# Altium project UWB_board.PrjPcb
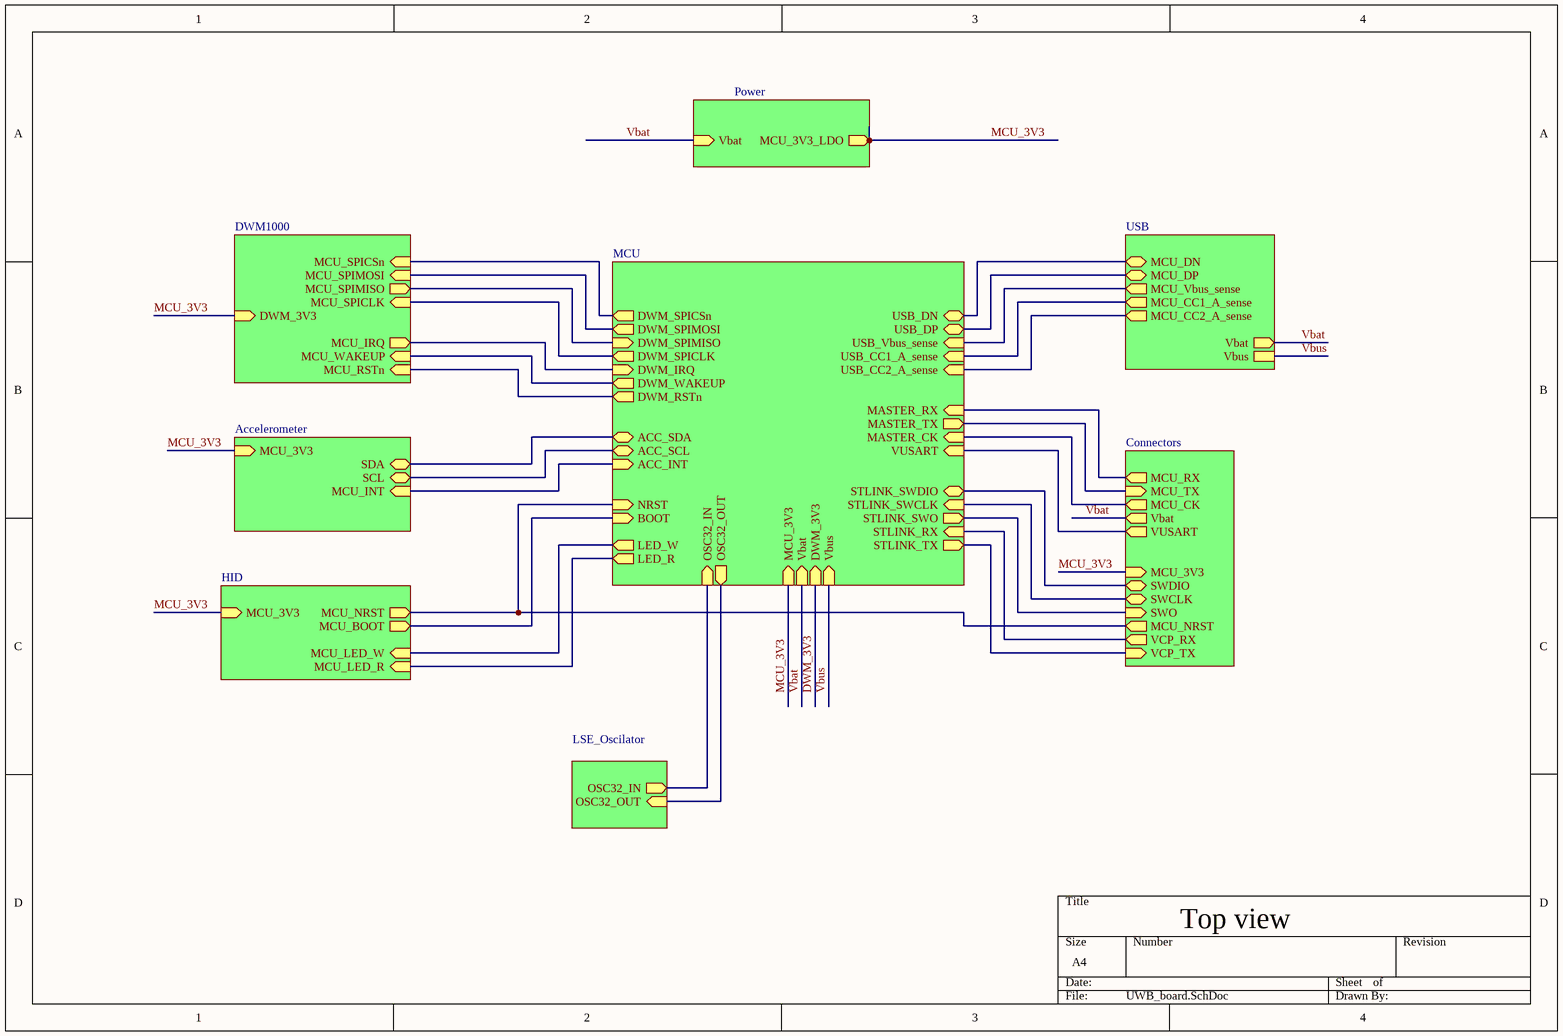
[diagram p0: UWB_board.SchDoc]
9 sheets, 52 parts. Net scope: hierarchical (ports join the sheet entries above them; power ports are global).
Board file: UWB_board.PcbDoc
Sheets:
  UWB_board.SchDoc
     = MCU.SchDoc
     = Power.SchDoc
     = LSE_Oscilator.SchDoc
     = USB.SchDoc
     = Connectors.SchDoc
     = HID.SchDoc
     = DWM1000.SchDoc
     = Accelerometer.SchDoc

## Sheet UWB_board.SchDoc: Top view
size A4; Author: Jan Jiří Bauer; DrawnBy: Jan Jiří Bauer; Revision: 1.1; SheetNumber: 1; SheetTotal: 9

### Sub-sheets
? = MCU: DWM_SPICSn (out), DWM_SPIMOSI (out), DWM_SPIMISO (in), DWM_SPICLK (out), DWM_IRQ (in), DWM_WAKEUP (out), DWM_RSTn (out), USB_DN (bidir), USB_DP (bidir), USB_Vbus_sense (in), USB_CC1_A_sense (in), USB_CC2_A_sense (in), MASTER_RX (in), MASTER_TX (out), MASTER_CK (in), VUSART (in), STLINK_SWDIO (bidir), STLINK_SWCLK (in), NRST (in), STLINK_RX (in), STLINK_TX (out), ACC_SDA (bidir), ACC_SCL (bidir), ACC_INT (in), BOOT (in), OSC32_IN (in), OSC32_OUT (out), MCU_3V3 (in), Vbat (in), DWM_3V3 (in), Vbus (in), STLINK_SWO (out), LED_W (out), LED_R (out)
? = Power: MCU_3V3_LDO (out), Vbat (in)
? = LSE_Oscilator: OSC32_IN (out), OSC32_OUT (in)
? = USB: MCU_DP (bidir), MCU_DN (bidir), MCU_CC1_A_sense (out), MCU_CC2_A_sense (out), MCU_Vbus_sense (out), Vbat (out), Vbus
? = Connectors: MCU_TX (in), MCU_RX (out), MCU_CK (out), Vbat (out), VUSART (out), MCU_3V3 (in), SWDIO (bidir), SWCLK (bidir), MCU_NRST (out), VCP_TX (in), VCP_RX (out), SWO (in)
? = HID: MCU_3V3 (in), MCU_NRST (out), MCU_BOOT (out), MCU_LED_R (in), MCU_LED_W (in)
? = DWM1000: MCU_SPICSn (in), MCU_SPIMOSI (in), MCU_SPIMISO (out), MCU_SPICLK (in), DWM_3V3 (in), MCU_IRQ (out), MCU_WAKEUP (in), MCU_RSTn (in)
? = Accelerometer: MCU_3V3 (in), SDA (bidir), SCL (bidir), MCU_INT (in)

### Nets
D_N: sheet /USB_DN, sheet /MCU_DN
D_P: sheet /USB_DP, sheet /MCU_DP
DWM_3V3: sheet /DWM_3V3
MCU_3V3: sheet /MCU_3V3, sheet /MCU_3V3_LDO, sheet /MCU_3V3, sheet /MCU_3V3, sheet /DWM_3V3, sheet /MCU_3V3
NRST: sheet /NRST, sheet /MCU_NRST, sheet /MCU_NRST
PA0: sheet /DWM_IRQ, sheet /MCU_IRQ
PA1: sheet /DWM_SPICSn, sheet /MCU_SPICSn
PA15: sheet /STLINK_SWO, sheet /SWO
PB3: sheet /DWM_SPICLK, sheet /MCU_SPICLK
PB4: sheet /DWM_SPIMISO, sheet /MCU_SPIMISO
PB5: sheet /DWM_SPIMOSI, sheet /MCU_SPIMOSI
PB6: sheet /LED_R, sheet /MCU_LED_R
PB7: sheet /LED_W, sheet /MCU_LED_W
PB8: sheet /ACC_SCL, sheet /SCL
PB9: sheet /ACC_SDA, sheet /SDA
PC13: sheet /ACC_INT, sheet /MCU_INT
PF0: sheet /DWM_WAKEUP, sheet /MCU_WAKEUP
Vbat: sheet /Vbat, sheet /Vbat, sheet /Vbat, sheet /Vbat
Vbus: sheet /Vbus, sheet /Vbus
NetC8_2: sheet /OSC32_IN, sheet /OSC32_IN
NetC9_2: sheet /OSC32_OUT, sheet /OSC32_OUT
NetC12_2: sheet /BOOT, sheet /MCU_BOOT
NetJ1_2: sheet /VUSART, sheet /VUSART
NetJ4_1: sheet /MASTER_TX, sheet /MCU_TX
NetJ4_2: sheet /MASTER_RX, sheet /MCU_RX
NetJ4_3: sheet /MASTER_CK, sheet /MCU_CK
NetJ5_4: sheet /STLINK_SWDIO, sheet /SWDIO
NetJ5_6: sheet /STLINK_SWCLK, sheet /SWCLK
NetJ5_13: sheet /STLINK_RX, sheet /VCP_RX
NetJ5_14: sheet /STLINK_TX, sheet /VCP_TX
NetR3_1: sheet /USB_CC1_A_sense, sheet /MCU_CC1_A_sense
NetR4_1: sheet /USB_CC2_A_sense, sheet /MCU_CC2_A_sense
NetR10_1: sheet /USB_Vbus_sense, sheet /MCU_Vbus_sense
NetU1_6: sheet /DWM_RSTn, sheet /MCU_RSTn

### Notes on the sheet
- Top view

## Sheet MCU.SchDoc
size A4; SheetNumber: 2; SheetTotal: 9
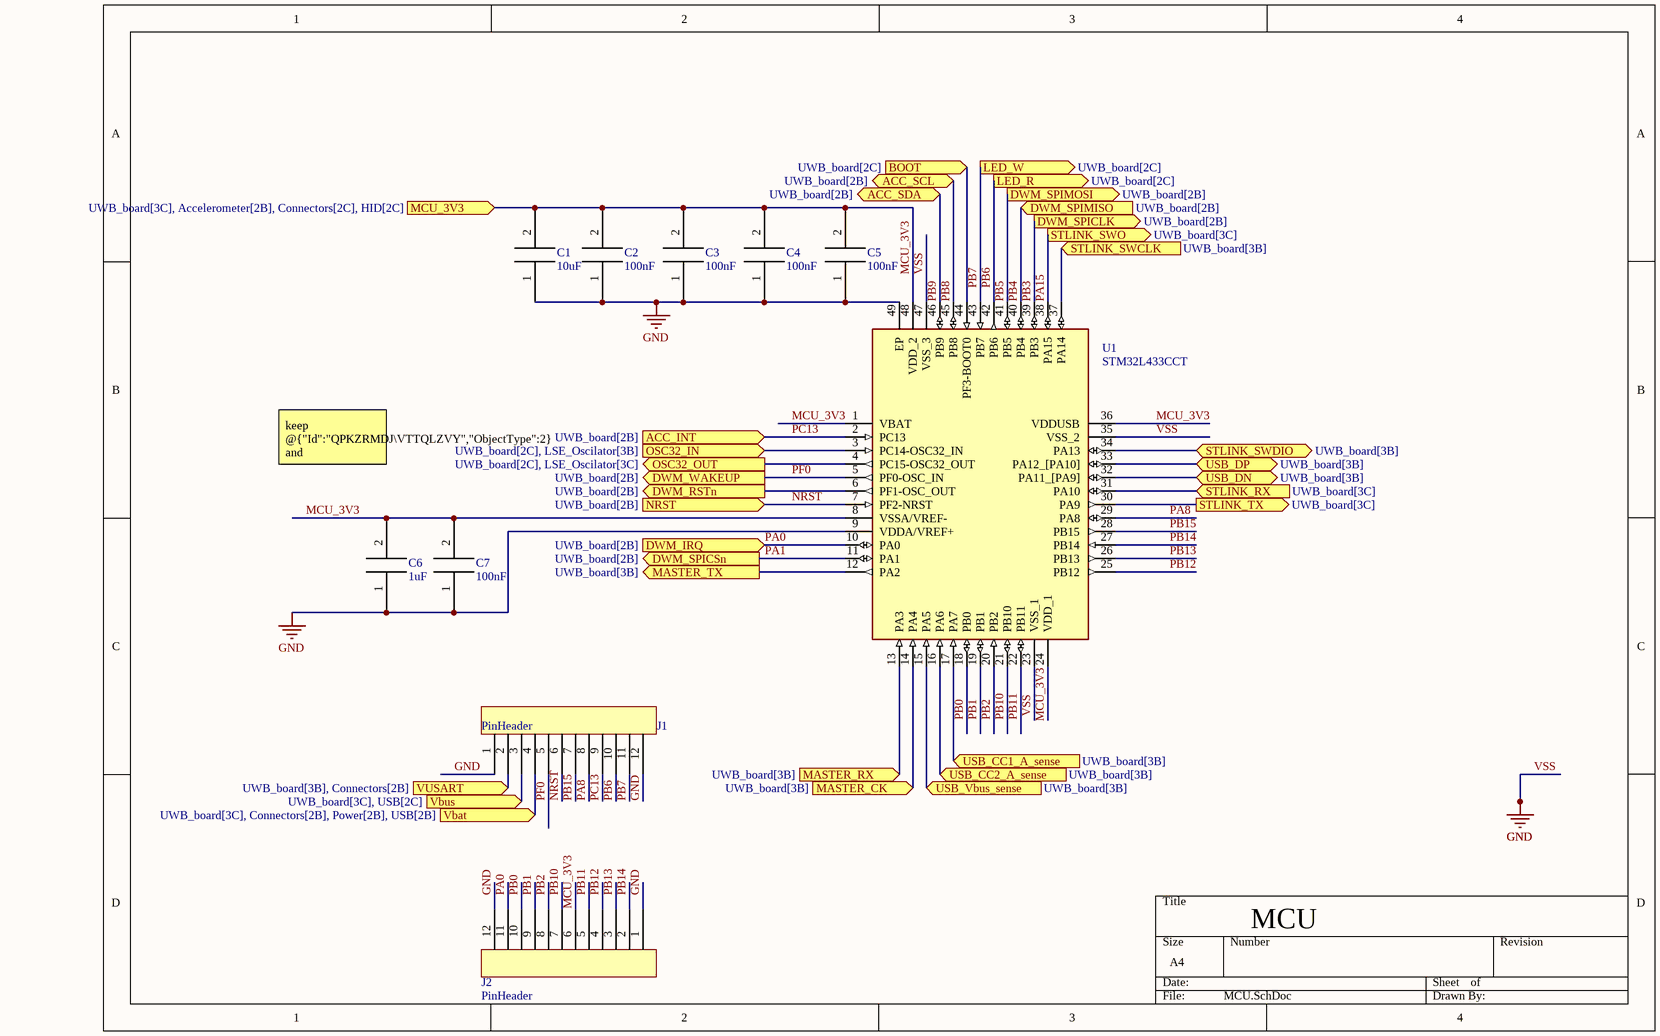
[diagram p1: MCU.SchDoc]

### Parts
C1  10uF  [0603_cap]
C2  100nF  [0603_cap]
C3  100nF  [0603_cap]
C4  100nF  [0603_cap]
C5  100nF  [0603_cap]
C6  1uF  [0603_cap]
C7  100nF  [0603_cap]
J1  PinHeader  [PINs]
J2  PinHeader  [PINs]
U1  STM32L433CCT  [LQFP50]

### Ports
ACC_INT (in, see UWB_board[2B]), ACC_SCL (bidir, see UWB_board[2B]), ACC_SDA (bidir, see UWB_board[2B]), BOOT (in, see UWB_board[2C]), DWM_IRQ (in, see UWB_board[2B]), DWM_RSTn (out, see UWB_board[2B]), DWM_SPICLK (out, see UWB_board[2B]), DWM_SPICSn (out, see UWB_board[2B]), DWM_SPIMISO (in, see UWB_board[2B]), DWM_SPIMOSI (out, see UWB_board[2B]), DWM_WAKEUP (out, see UWB_board[2B]), LED_R (out, see UWB_board[2C]), LED_W (out, see UWB_board[2C]), MASTER_CK (in, see UWB_board[3B]), MASTER_RX (in, see UWB_board[3B]), MASTER_TX (out, see UWB_board[3B]), MCU_3V3 (in, see UWB_board[3C], Accelerometer[2B], Connectors[2C], HID[2C]), NRST (in, see UWB_board[2B]), OSC32_IN (in, see UWB_board[2C], LSE_Oscilator[3B]), OSC32_OUT (out, see UWB_board[2C], LSE_Oscilator[3C]), STLINK_RX (in, see UWB_board[3C]), STLINK_SWCLK (in, see UWB_board[3B]), STLINK_SWDIO (bidir, see UWB_board[3B]), STLINK_SWO (out, see UWB_board[3C]), STLINK_TX (out, see UWB_board[3C]), USB_CC1_A_sense (in, see UWB_board[3B]), USB_CC2_A_sense (in, see UWB_board[3B]), USB_DN (bidir, see UWB_board[3B]), USB_DP (bidir, see UWB_board[3B]), USB_Vbus_sense (in, see UWB_board[3B]), Vbat (in, see UWB_board[3C], Connectors[2B], Power[2B], USB[2B]), Vbus (in, see UWB_board[3C], USB[2C]), VUSART (in, see UWB_board[3B], Connectors[2B])

### Nets
GND: C1.1 C2.1 C3.1 C4.1 C5.1 C6.1 C7.1 J1.1 J1.12 J2.1 J2.12 U1.9(VDDA/VREF+) U1.23(VSS_1) U1.35(VSS_2) U1.47(VSS_3) U1.49(EP)  [also labelled VSS]
D_N: U1.32(PA11_[PA9]) ; port USB_DN
D_P: U1.33(PA12_[PA10]) ; port USB_DP
MCU_3V3: C1.2 C2.2 C3.2 C4.2 C5.2 C6.2 C7.2 J2.6 U1.1(VBAT) U1.8(VSSA/VREF-) U1.24(VDD_1) U1.36(VDDUSB) U1.48(VDD_2) ; port MCU_3V3
NRST: J1.6 U1.7(PF2-NRST) ; port NRST
PA0: J2.11 U1.10(PA0) ; port DWM_IRQ
PA1: U1.11(PA1) ; port DWM_SPICSn
PA8: J1.8 U1.29(PA8)
PA15: U1.38(PA15) ; port STLINK_SWO
PB0: J2.10 U1.18(PB0)
PB1: J2.9 U1.19(PB1)
PB2: J2.8 U1.20(PB2)
PB3: U1.39(PB3) ; port DWM_SPICLK
PB4: U1.40(PB4) ; port DWM_SPIMISO
PB5: U1.41(PB5) ; port DWM_SPIMOSI
PB6: J1.10 U1.42(PB6) ; port LED_R
PB7: J1.11 U1.43(PB7) ; port LED_W
PB8: U1.45(PB8) ; port ACC_SCL
PB9: U1.46(PB9) ; port ACC_SDA
PB10: J2.7 U1.21(PB10)
PB11: J2.5 U1.22(PB11)
PB12: J2.4 U1.25(PB12)
PB13: J2.3 U1.26(PB13)
PB14: J2.2 U1.27(PB14)
PB15: J1.7 U1.28(PB15)
PC13: J1.9 U1.2(PC13) ; port ACC_INT
PF0: J1.5 U1.5(PF0-OSC_IN) ; port DWM_WAKEUP
Vbat: J1.4 ; port Vbat
Vbus: J1.3 ; port Vbus
NetC8_2: U1.3(PC14-OSC32_IN) ; port OSC32_IN
NetC9_2: U1.4(PC15-OSC32_OUT) ; port OSC32_OUT
NetC12_2: U1.44(PF3-BOOT0) ; port BOOT
NetJ1_2: J1.2 ; port VUSART
NetJ4_1: U1.12(PA2) ; port MASTER_TX
NetJ4_2: U1.13(PA3) ; port MASTER_RX
NetJ4_3: U1.14(PA4) ; port MASTER_CK
NetJ5_4: U1.34(PA13) ; port STLINK_SWDIO
NetJ5_6: U1.37(PA14) ; port STLINK_SWCLK
NetJ5_13: U1.31(PA10) ; port STLINK_RX
NetJ5_14: U1.30(PA9) ; port STLINK_TX
NetR3_1: U1.17(PA7) ; port USB_CC1_A_sense
NetR4_1: U1.16(PA6) ; port USB_CC2_A_sense
NetR10_1: U1.15(PA5) ; port USB_Vbus_sense
NetU1_6: U1.6(PF1-OSC_OUT) ; port DWM_RSTn

### Notes on the sheet
- keep @{"Id":"QPKZRMDJ\VTTQLZVY","ObjectType":2} and @{"Id":"QPKZRMDJ\RWWDCKLV","ObjectType":2} close to VSSA and VDDA pins
- MCU

### Library data of the parts
C1 = CL10A106KP8NNNC: 100nF 50V X7R ±10% 0603 Multilayer Ceramic Capacitors MLCC - SMD/SMT ROHS; LCSC Part #: C19702; Value: 10uF
C2-C5 C7 = CC0603KRX7R9BB104: 100nF 50V X7R ±10% 0603 Multilayer Ceramic Capacitors MLCC - SMD/SMT ROHS; LCSC Part #: C14663; Value: 100nF
C6 = CL10A105KB8NNNC: 1uF 50V X5R ±10% 0603 Multilayer Ceramic Capacitors MLCC - SMD/SMT ROHS; LCSC Part #: C15849; Value: 1uF
U1 = STM32L433CCT: Manufacturer_Name: STMicroelectronics; Manufacturer_Part_Number: STM32L433CCT

## Sheet Power.SchDoc
size A4; SheetNumber: 7; SheetTotal: 9
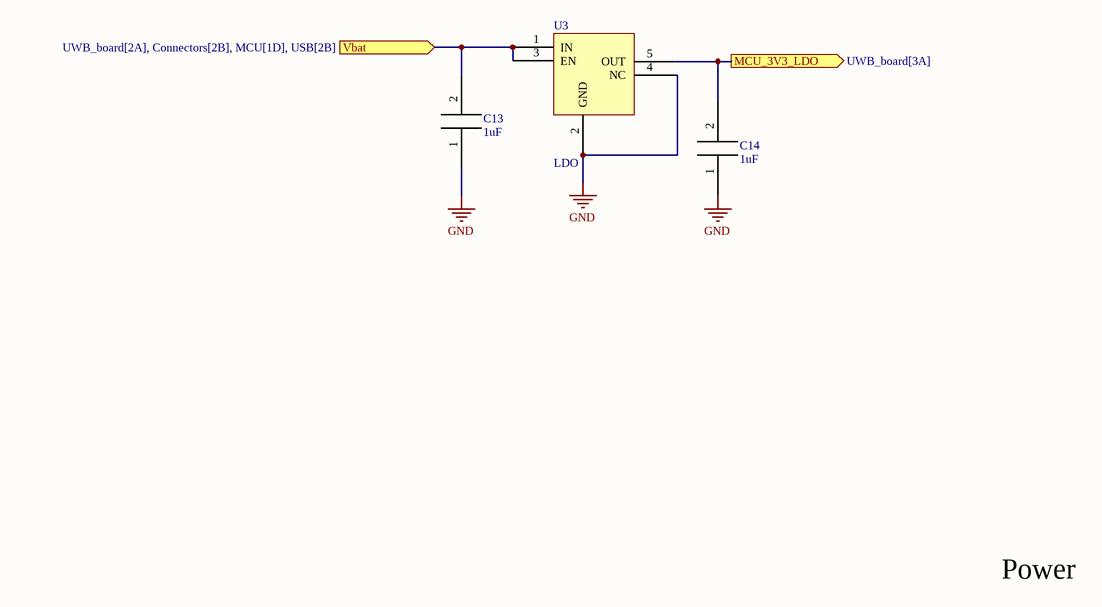
[diagram p2: Power.SchDoc]

### Parts
C13  1uF  [0603_cap]
C14  1uF  [0603_cap]
U3  LDO  [SOT95P280X145-5N]

### Ports
MCU_3V3_LDO (out, see UWB_board[3A]), Vbat (in, see UWB_board[2A], Connectors[2B], MCU[1D], USB[2B])

### Nets
GND: C13.1 C14.1 U3.2(GND) U3.4(NC)
MCU_3V3: C14.2 U3.5(OUT) ; port MCU_3V3_LDO
Vbat: C13.2 U3.1(IN) U3.3(EN) ; port Vbat

### Notes on the sheet
- Power

### Library data of the parts
C13 C14 = CL10A105KB8NNNC: as C6 on sheet MCU; LCSC Part #: C15849; Value: 1uF
U3 = TPS7A20: LCSC Part #: C2862740

## Sheet LSE_Oscilator.SchDoc
size A4; SheetNumber: 3; SheetTotal: 9
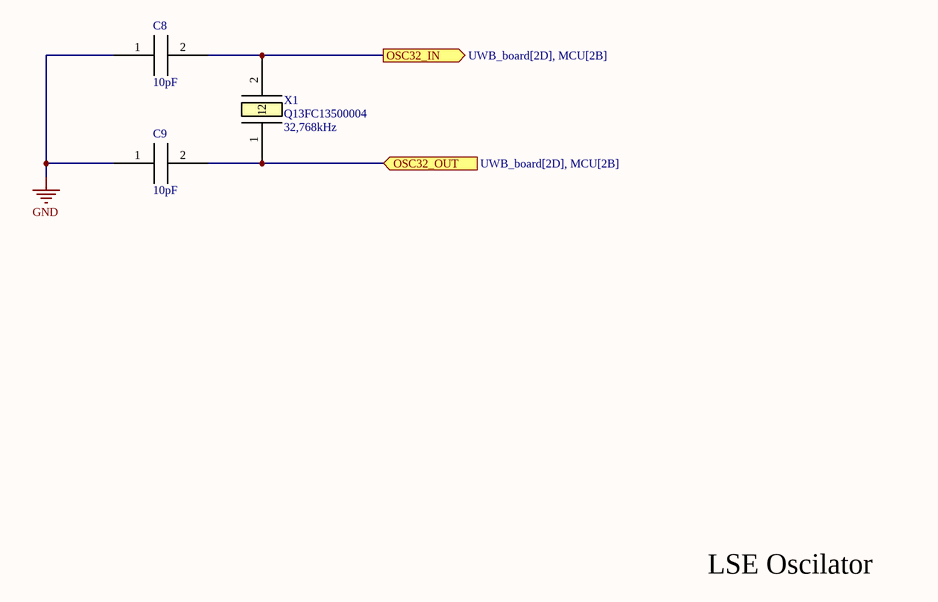
[diagram p3: LSE_Oscilator.SchDoc]

### Parts
C8  10pF  [0603_cap]
C9  10pF  [0603_cap]
X1  Q13FC13500004  Parameter: 32,768kHz  [SMD3215-2P]

### Ports
OSC32_IN (out, see UWB_board[2D], MCU[2B]), OSC32_OUT (in, see UWB_board[2D], MCU[2B])

### Nets
GND: C8.1 C9.1
NetC8_2: C8.2 X1.2 ; port OSC32_IN
NetC9_2: C9.2 X1.1 ; port OSC32_OUT

### Notes on the sheet
- LSE Oscilator

### Library data of the parts
C8 C9 = CL10C100JB8NNNC: 10pF 50V C0G ±5% 0603 Multilayer Ceramic Capacitors MLCC - SMD/SMT ROHS; LCSC Part #: C1634; Value: 10pF
X1 = Q13FC13500004: -40℃~+85℃ 12.5pF 32.768kHz 70kΩ Crystal Oscillator ±20ppm SMD3215-2P Crystals ROHS; ComponentLink1Description: New link; ComponentLink1URL: https://jlcpcb.com/partdetail/SeikoEpson-Q13FC13500004/C32346; LCSC Part #: C32346

## Sheet USB.SchDoc
size A4; SheetNumber: 4; SheetTotal: 10
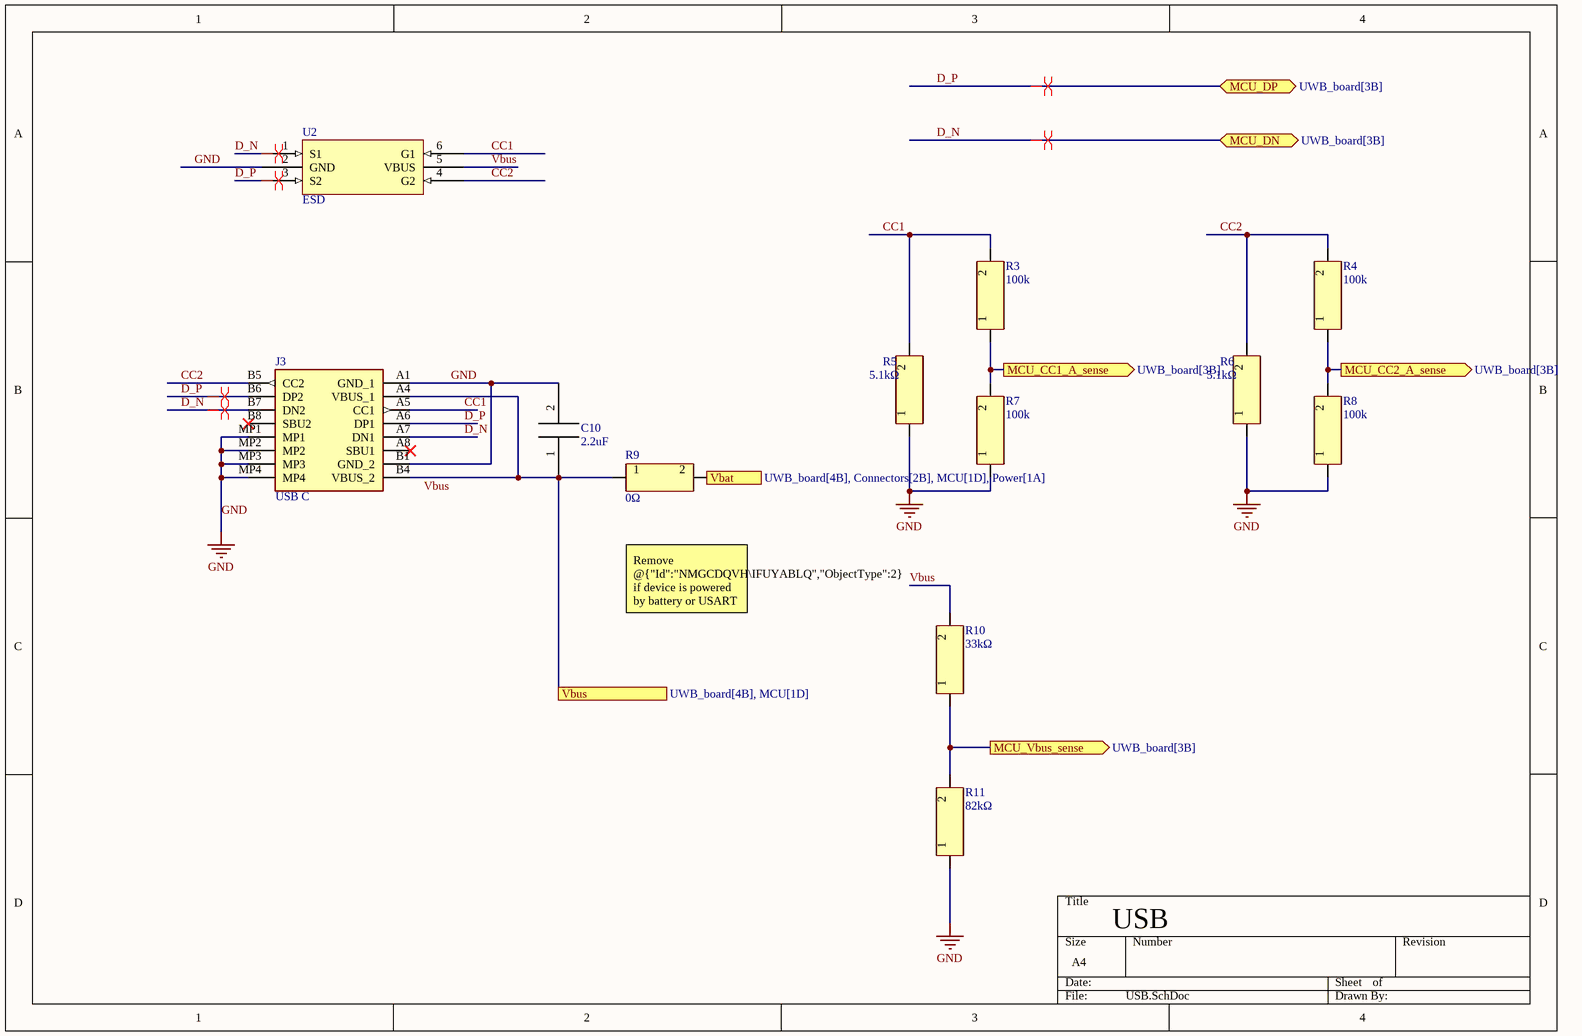
[diagram p4: USB.SchDoc]

### Parts
C10  2.2uF  [0603_cap]
J3  USB C  [UJ20CHGSMT5P16TR]
R3  100k  [0603_res]
R4  100k  [0603_res]
R5  value 5.1kΩ  [0603_res]  (hidden comment: 5.1k)
R6  value 5.1kΩ  [0603_res]  (hidden comment: 5.1k)
R7  100k  [0603_res]
R8  100k  [0603_res]
R9  value 0Ω  [0603_res]  (hidden comment: 0R)
R10  value 33kΩ  [0603_res]  (hidden comment: 33k)
R11  value 82kΩ  [0603_res]  (hidden comment: 82k)
U2  ESD  [sot-23-6L_ESD]

### Ports
MCU_CC1_A_sense (out, see UWB_board[3B]), MCU_CC2_A_sense (out, see UWB_board[3B]), MCU_DN (bidir, see UWB_board[3B]), MCU_DP (bidir, see UWB_board[3B]), MCU_Vbus_sense (out, see UWB_board[3B]), Vbat (out, see UWB_board[4B], Connectors[2B], MCU[1D], Power[1A]), Vbus (see UWB_board[4B], MCU[1D])

### Nets
GND: C10.2 J3.A1(GND_1) J3.B1(GND_2) J3.MP1 J3.MP2 J3.MP3 J3.MP4 R5.1 R6.1 R7.1 R8.1 R11.1 U2.2(GND)
CC1: J3.A5(CC1) R3.2 R5.2 U2.6(G1)
CC2: J3.B5(CC2) R4.2 R6.2 U2.4(G2)
D_N: J3.A7(DN1) J3.B7(DN2) U2.1(S1) ; port MCU_DN
D_P: J3.A6(DP1) J3.B6(DP2) U2.3(S2) ; port MCU_DP
Vbat: R9.2 ; port Vbat
Vbus: C10.1 J3.A4(VBUS_1) J3.B4(VBUS_2) R9.1 R10.2 U2.5(VBUS) ; port Vbus
NetR3_1: R3.1 R7.2 ; port MCU_CC1_A_sense
NetR4_1: R4.1 R8.2 ; port MCU_CC2_A_sense
NetR10_1: R10.1 R11.2 ; port MCU_Vbus_sense

Not connected (* = marked no-connect by the designer): J3 A8(SBU1)* B8(SBU2)*

### Layout directives
differential pair; Impedance: 90 +-15%: D_N, D_P
differential pair: D_N

### Notes on the sheet
- Remove @{"Id":"NMGCDQVH\IFUYABLQ","ObjectType":2} if device is powered by battery or USART
- USB

### Library data of the parts
C10 = CL10A225KO8NNNC: 2.2uF 16V X5R ±10% 0603 Multilayer Ceramic Capacitors MLCC - SMD/SMT ROHS; LCSC Part #: C23630; Value: 2.2uF
J3 = UJ20-C-H-G-SMT-5-P16-TR: Type C, USB 2.0, 480 Mbps, 48 Vac, 5 A, Horizontal, Gold Plated 3u, Surface Mount with post, 16 pin, USB Receptacle; Mouser Part Number: 179-UJ20CHGSMT5P16TR; LCSC Part #: C22383469
R3 R4 R7 R8 = 0603WAF1003T5E: 100kΩ -55℃~+155℃ 100kΩ 100mW 75V Thick Film Resistor ±1% ±100ppm/℃ 0603 Chip Resistor - Surface Mount ROHS; LCSC Part #: C25803; Value: 100k
R5 R6 = 0603WAF5101T5E: 5.1kΩ -55℃~+155℃ 100mW 75V Thick Film Resistor ±1% ±100ppm/℃ 0603 Chip Resistor - Surface Mount ROHS; LCSC Part #: C23186
R9 = 0603WAF0000T5E: 0Ω -55℃~+155℃ 100mW 75V Thick Film Resistor ±1% ±100ppm/℃ 0603 Chip Resistor - Surface Mount ROHS; LCSC Part #: C21189
R10 = 0603WAF3302T5E: 33kΩ -55℃~+155℃ 100mW 75V Thick Film Resistor ±1% ±100ppm/℃ 0603 Chip Resistor - Surface Mount ROHS; LCSC Part #: C4216
R11 = 0603WAF8202T5E: 82kΩ -55℃~+155℃ 100mW 75V Thick Film Resistor ±1% ±100ppm/℃ 0603 Chip Resistor - Surface Mount ROHS; LCSC Part #: C23254
U2 = SRV05-4: -55℃~+155℃ 12.5V 1pF 5 5A 5V 5uA 6V 75W ESD IEC 61000-4-2 Unidirectional SOT-23-6L ESD and Surge Protection (TVS/ESD) ROHS; LCSC Part #: C7420376

## Sheet Connectors.SchDoc
size A4; SheetNumber: 5; SheetTotal: 10
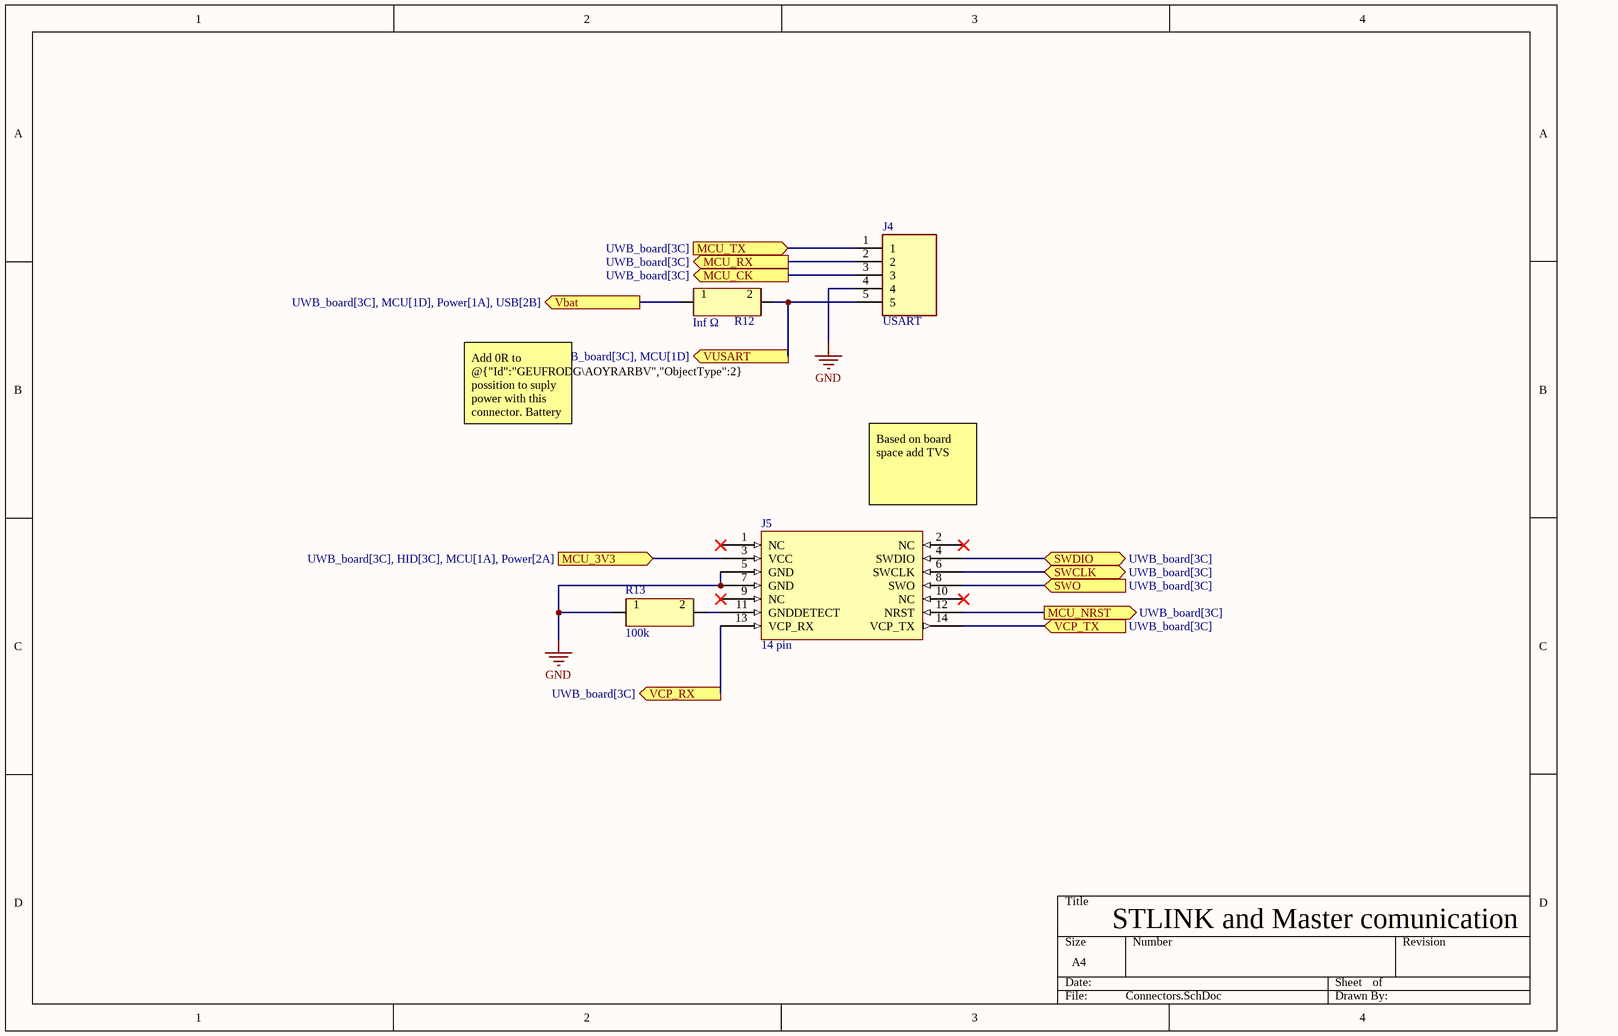
[diagram p5: Connectors.SchDoc]

### Parts
J4  USART  [JST_B5B-XH-A]
J5  14 pin  [FTSH14]
R12  value Inf Ω  [0603_empty]  (hidden comment: Empty 0603)
R13  100k  [0603_res]

### Ports
MCU_3V3 (in, see UWB_board[3C], HID[3C], MCU[1A], Power[2A]), MCU_CK (out, see UWB_board[3C]), MCU_NRST (out, see UWB_board[3C]), MCU_RX (out, see UWB_board[3C]), MCU_TX (in, see UWB_board[3C]), SWCLK (bidir, see UWB_board[3C]), SWDIO (bidir, see UWB_board[3C]), SWO (in, see UWB_board[3C]), Vbat (out, see UWB_board[3C], MCU[1D], Power[1A], USB[2B]), VCP_RX (out, see UWB_board[3C]), VCP_TX (in, see UWB_board[3C]), VUSART (out, see UWB_board[3C], MCU[1D])

### Nets
GND: J4.4 J5.5(GND) J5.7(GND) R13.1
MCU_3V3: J5.3(VCC) ; port MCU_3V3
NRST: J5.12(NRST) ; port MCU_NRST
PA15: J5.8(SWO) ; port SWO
Vbat: R12.1 ; port Vbat
NetJ1_2: J4.5 R12.2 ; port VUSART
NetJ4_1: J4.1 ; port MCU_TX
NetJ4_2: J4.2 ; port MCU_RX
NetJ4_3: J4.3 ; port MCU_CK
NetJ5_4: J5.4(SWDIO) ; port SWDIO
NetJ5_6: J5.6(SWCLK) ; port SWCLK
NetJ5_11: J5.11(GNDDETECT) R13.2
NetJ5_13: J5.13(VCP_RX) ; port VCP_RX
NetJ5_14: J5.14(VCP_TX) ; port VCP_TX

Not connected (* = marked no-connect by the designer): J5 1(NC)* 2(NC)* 9(NC)* 10(NC)*

### Notes on the sheet
- Add 0R to @{"Id":"GEUFRODG\AOYRARBV","ObjectType":2}  possition to suply power with this connector. Battery and USB cannot be present
- (near J5) Based on board space add TVS
- STLINK and Master comunication

### Library data of the parts
J4 = S5B-XH-A_LF__SN_: comunication to master
J5 = FTSH-107-01-LM-DV-K: For SWD debug
R12 = 0603_empty: empty space for 0603 device; LCSC Part #: None
R13 = 0603WAF1003T5E: as R3 on sheet USB; LCSC Part #: C25803; Value: 100k

## Sheet HID.SchDoc
size A4; SheetNumber: 6; SheetTotal: 10
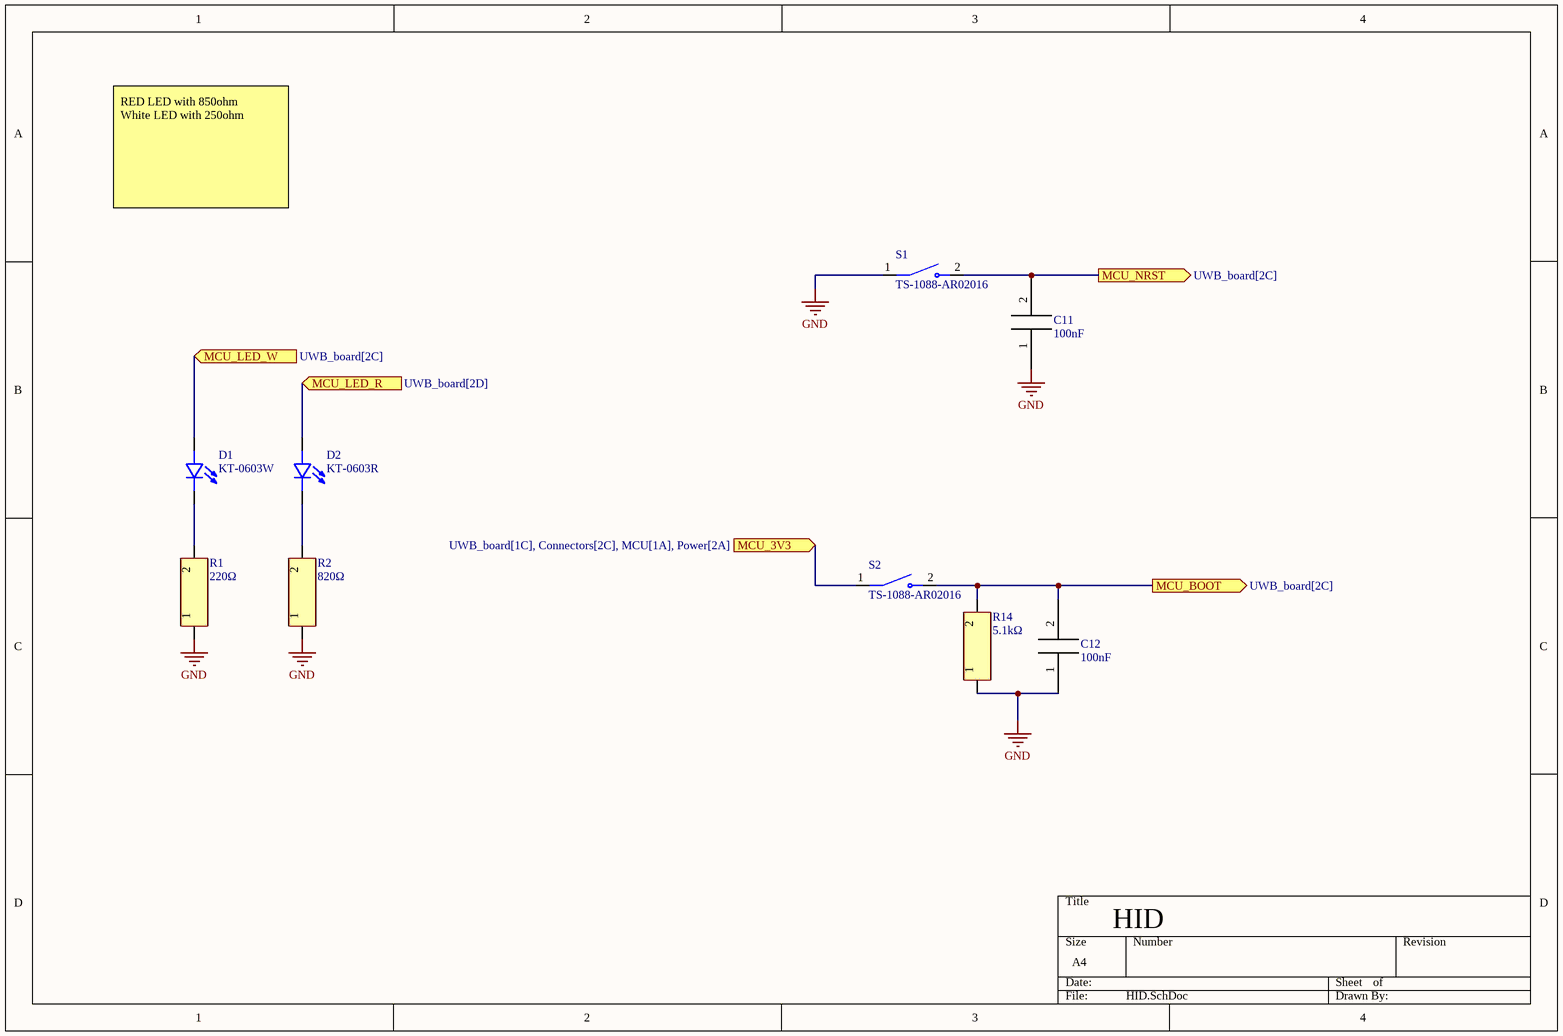
[diagram p6: HID.SchDoc]

### Parts
C11  100nF  [0603_cap]
C12  100nF  [0603_cap]
D1  KT-0603W  [0603_LED]
D2  KT-0603R  [0603_LED]
R1  value 220Ω  [0603_res]  (hidden comment: 220)
R2  value 820Ω  [0603_res]  (hidden comment: 820)
R14  value 5.1kΩ  [0603_res]  (hidden comment: 5.1k)
S1  TS-1088-AR02016  [SW_TS-1088-AR02016]
S2  TS-1088-AR02016  [SW_TS-1088-AR02016]

### Ports
MCU_3V3 (in, see UWB_board[1C], Connectors[2C], MCU[1A], Power[2A]), MCU_BOOT (out, see UWB_board[2C]), MCU_LED_R (in, see UWB_board[2D]), MCU_LED_W (in, see UWB_board[2C]), MCU_NRST (out, see UWB_board[2C])

### Nets
GND: C11.1 C12.1 R1.1 R2.1 R14.1 S1.1
MCU_3V3: S2.1 ; port MCU_3V3
NRST: C11.2 S1.2 ; port MCU_NRST
PB6: D2.A ; port MCU_LED_R
PB7: D1.A ; port MCU_LED_W
NetC12_2: C12.2 R14.2 S2.2 ; port MCU_BOOT
NetD1_C: D1.C R1.2
NetD2_C: D2.C R2.2

### Notes on the sheet
- RED LED with 850ohm
  White LED with 250ohm
- HID

### Library data of the parts
C11 C12 = CC0603KRX7R9BB104: as C2 on sheet MCU; LCSC Part #: C14663; Value: 100nF
D1 = KT-0603W: 100mW 120° 2.6V~3.1V 360mcd 5mA Discrete Diode White Yellow Lens op View Mount 0603 LED Indication - Discrete ROHS; LCSC Part #: C2290
D2 = KT-0603R: -40℃~+85℃ 120° 2.4V 20mA 300mcd 40mW 615nm~630nm 645nm Red Water Clear 0603 LED Indication - Discrete ROHS; LCSC Part #: C2286
R1 = 0603WAF2200T5E: 220Ω -55℃~+155℃ 100mW 75V Thick Film Resistor ±1% ±100ppm/℃ 0603 Chip Resistor - Surface Mount ROHS; LCSC Part #: C22962
R2 = 0603WAF8200T5E: 820Ω -55℃~+155℃ 100mW 75V Thick Film Resistor ±1% ±100ppm/℃ 0603 Chip Resistor - Surface Mount ROHS; LCSC Part #: C23253
R14 = 0603WAF5101T5E: as R5 on sheet USB; LCSC Part #: C23186
S1 S2 = TS-1088-AR02016: 50mA 4mm 100MÎ© 100,000 Times 12V 160gf 3mm 2mm Round Button Vertical welding SPST SMD Tactile Switches ROHS; LCSC Part #: C720477

## Sheet DWM1000.SchDoc
size A4; SheetNumber: 8; SheetTotal: 10
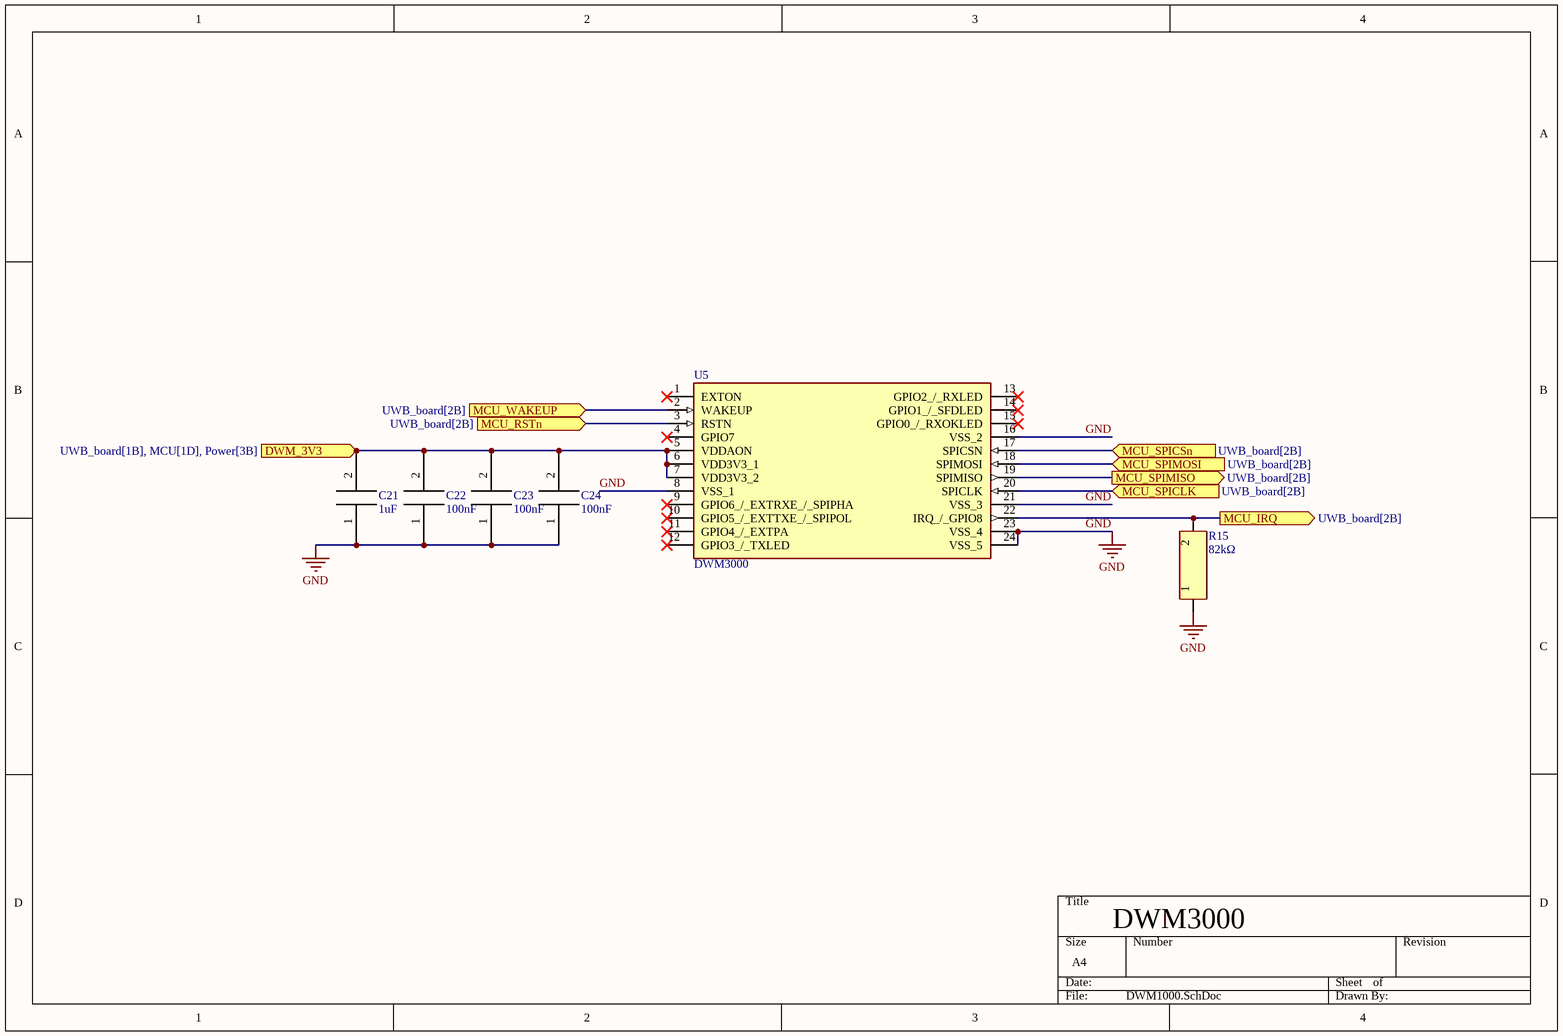
[diagram p7: DWM1000.SchDoc]

### Parts
C21  1uF  [0603_cap]
C22  100nF  [0603_cap]
C23  100nF  [0603_cap]
C24  100nF  [0603_cap]
R15  value 82kΩ  [0603_res]  (hidden comment: 82k)
U5  DWM3000  [DWM1000]

### Ports
DWM_3V3 (in, see UWB_board[1B], MCU[1D], Power[3B]), MCU_IRQ (out, see UWB_board[2B]), MCU_RSTn (in, see UWB_board[2B]), MCU_SPICLK (in, see UWB_board[2B]), MCU_SPICSn (in, see UWB_board[2B]), MCU_SPIMISO (out, see UWB_board[2B]), MCU_SPIMOSI (in, see UWB_board[2B]), MCU_WAKEUP (in, see UWB_board[2B])

### Nets
GND: C21.1 C22.1 C23.1 C24.1 R15.1 U5.8(VSS_1) U5.16(VSS_2) U5.21(VSS_3) U5.23(VSS_4) U5.24(VSS_5)
MCU_3V3: C21.2 C22.2 C23.2 C24.2 U5.5(VDDAON) U5.6(VDD3V3_1) U5.7(VDD3V3_2) ; port DWM_3V3
PA0: R15.2 U5.22(IRQ_/_GPIO8) ; port MCU_IRQ
PA1: U5.17(SPICSN) ; port MCU_SPICSn
PB3: U5.20(SPICLK) ; port MCU_SPICLK
PB4: U5.19(SPIMISO) ; port MCU_SPIMISO
PB5: U5.18(SPIMOSI) ; port MCU_SPIMOSI
PF0: U5.2(WAKEUP) ; port MCU_WAKEUP
NetU1_6: U5.3(RSTN) ; port MCU_RSTn

Not connected (* = marked no-connect by the designer): U5 1(EXTON)* 4(GPIO7)* 9(GPIO6_/_EXTRXE_/_SPIPHA)* 10(GPIO5_/_EXTTXE_/_SPIPOL)* 11(GPIO4_/_EXTPA)* 12(GPIO3_/_TXLED)* 13(GPIO2_/_RXLED)* 14(GPIO1_/_SFDLED)* 15(GPIO0_/_RXOKLED)*

### Notes on the sheet
- DWM3000

### Library data of the parts
C21 = CL10A105KB8NNNC: as C6 on sheet MCU; LCSC Part #: C15849; Value: 1uF
C22-C24 = CC0603KRX7R9BB104: as C2 on sheet MCU; LCSC Part #: C14663; Value: 100nF
R15 = 0603WAF8202T5E: as R11 on sheet USB; LCSC Part #: C23254
U5 = DWM1000: 3.5 - 6.5 GHz Ultra-Wideband (UWB) Transceiver Module; Manufacturer_Name: Qorvo; Geometry.Height: 3.15mm; Mouser Part Number: 772-DWM1000; Mouser Price/Stock: https://www.mouser.co.uk/ProductDetail/Qorvo/DWM1000?qs=TiOZkKH1s2R6b5D6df63Pg%3D%3D; Manufacturer_Part_Number: DWM1000; Datasheet Link: https://www.qorvo.com/products/d/da007948

## Sheet Accelerometer.SchDoc
size A4; SheetNumber: 9; SheetTotal: 9
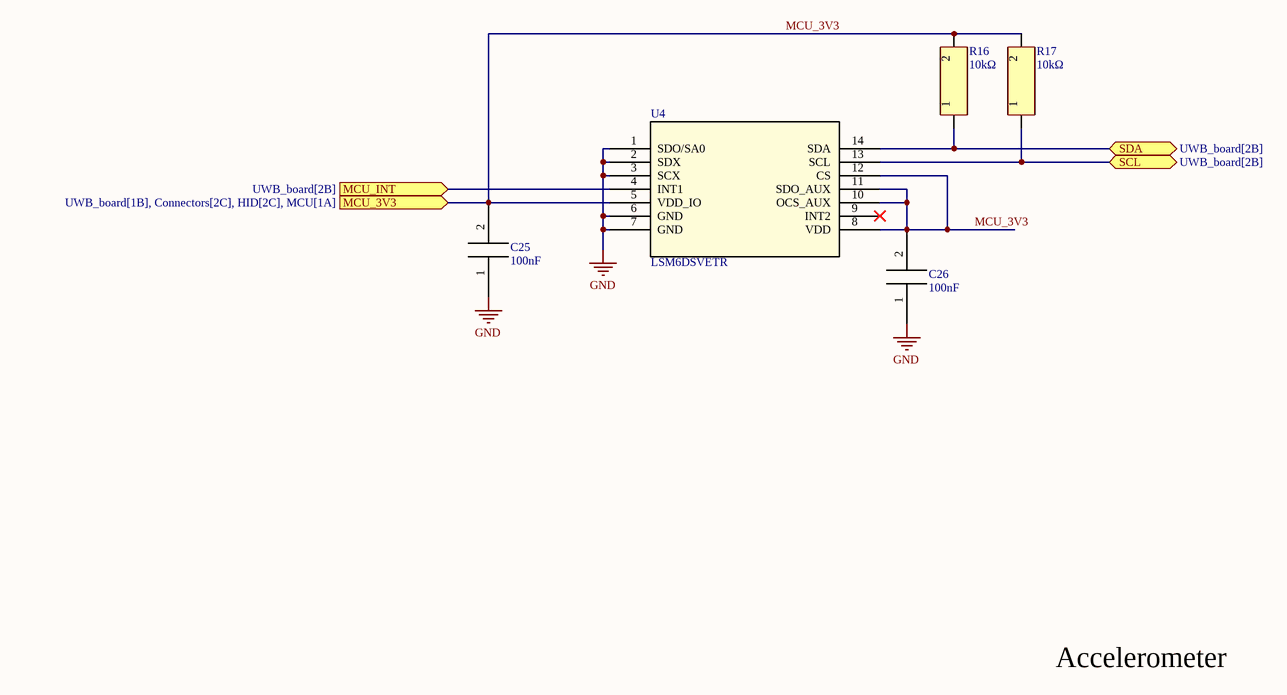
[diagram p8: Accelerometer.SchDoc]

### Parts
C25  100nF  [0603_cap]
C26  100nF  [0603_cap]
R16  value 10kΩ  [0603_res]  (hidden comment: 10k)
R17  value 10kΩ  [0603_res]  (hidden comment: 10k)
U4  LSM6DSVETR  [LGA14-L_2p59x3P1x0P5_STM]

### Ports
MCU_3V3 (in, see UWB_board[1B], Connectors[2C], HID[2C], MCU[1A]), MCU_INT (in, see UWB_board[2B]), SCL (bidir, see UWB_board[2B]), SDA (bidir, see UWB_board[2B])

### Nets
GND: C25.1 C26.1 U4.1(SDO/SA0) U4.2(SDX) U4.3(SCX) U4.6(GND) U4.7(GND)
MCU_3V3: C25.2 C26.2 R16.2 R17.2 U4.5(VDD_IO) U4.8(VDD) U4.10(OCS_AUX) U4.11(SDO_AUX) U4.12(CS) ; port MCU_3V3
PB8: R17.1 U4.13(SCL) ; port SCL
PB9: R16.1 U4.14(SDA) ; port SDA
PC13: U4.4(INT1) ; port MCU_INT

Not connected (* = marked no-connect by the designer): U4 9(INT2)*

### Notes on the sheet
- Accelerometer

### Library data of the parts
C25 C26 = CC0603KRX7R9BB104: as C2 on sheet MCU; LCSC Part #: C14663; Value: 100nF
R16 R17 = 0603WAF1002T5E: 10kΩ -55℃~+155℃ 100mW 75V Thick Film Resistor ±1% ±100ppm/℃ 0603 Chip Resistor - Surface Mount ROHS; LCSC Part #: C25804
U4 = LSM6DSVETR: 6-axis IMU with embedded sensor fusion, I3C, OIS/EIS for smart applications; LCSC Part #: C41785564

## Nets that join several sheets
GND: MCU (16 pins), Power (C13.1 C14.1 U3.2 U3.4), LSE_Oscilator (C8.1 C9.1), USB (13 pins), Connectors (J4.4 J5.5 J5.7 R13.1), HID (6 pins), DWM1000 (10 pins), Accelerometer (7 pins)
D_N: MCU (U1.32), USB (J3.A7 J3.B7 U2.1)
D_P: MCU (U1.33), USB (J3.A6 J3.B6 U2.3)
MCU_3V3: MCU (13 pins), Power (C14.2 U3.5), Connectors (J5.3), HID (S2.1), DWM1000 (7 pins), Accelerometer (9 pins)
NetC8_2: MCU (U1.3), LSE_Oscilator (C8.2 X1.2)
NetC9_2: MCU (U1.4), LSE_Oscilator (C9.2 X1.1)
NetC12_2: MCU (U1.44), HID (C12.2 R14.2 S2.2)
NetJ1_2: MCU (J1.2), Connectors (J4.5 R12.2)
NetJ4_1: MCU (U1.12), Connectors (J4.1)
NetJ4_2: MCU (U1.13), Connectors (J4.2)
NetJ4_3: MCU (U1.14), Connectors (J4.3)
NetJ5_4: MCU (U1.34), Connectors (J5.4)
NetJ5_6: MCU (U1.37), Connectors (J5.6)
NetJ5_13: MCU (U1.31), Connectors (J5.13)
NetJ5_14: MCU (U1.30), Connectors (J5.14)
NetR3_1: MCU (U1.17), USB (R3.1 R7.2)
NetR4_1: MCU (U1.16), USB (R4.1 R8.2)
NetR10_1: MCU (U1.15), USB (R10.1 R11.2)
NetU1_6: MCU (U1.6), DWM1000 (U5.3)
NRST: MCU (J1.6 U1.7), Connectors (J5.12), HID (C11.2 S1.2)
PA0: MCU (J2.11 U1.10), DWM1000 (R15.2 U5.22)
PA1: MCU (U1.11), DWM1000 (U5.17)
PA15: MCU (U1.38), Connectors (J5.8)
PB3: MCU (U1.39), DWM1000 (U5.20)
PB4: MCU (U1.40), DWM1000 (U5.19)
PB5: MCU (U1.41), DWM1000 (U5.18)
PB6: MCU (J1.10 U1.42), HID (D2.A)
PB7: MCU (J1.11 U1.43), HID (D1.A)
PB8: MCU (U1.45), Accelerometer (R17.1 U4.13)
PB9: MCU (U1.46), Accelerometer (R16.1 U4.14)
PC13: MCU (J1.9 U1.2), Accelerometer (U4.4)
PF0: MCU (J1.5 U1.5), DWM1000 (U5.2)
Vbat: MCU (J1.4), Power (C13.2 U3.1 U3.3), USB (R9.2), Connectors (R12.1)
Vbus: MCU (J1.3), USB (6 pins)